# Altium project Super Seal Breakout.PrjPcb
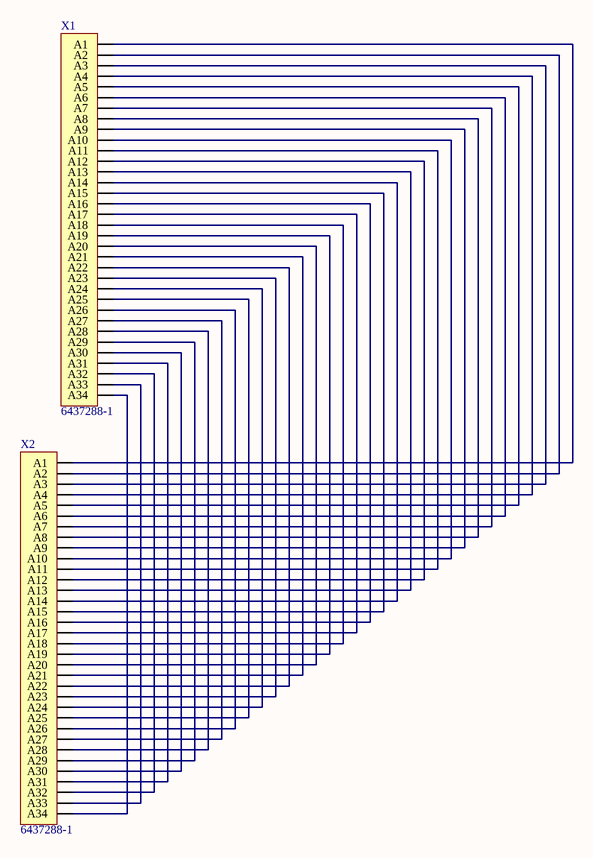
[diagram p0: breakout schematic.SchDoc]
1 sheet, 2 parts. Net scope: global (net labels, ports and power ports of the same name join across sheets).
Board file: Breakout pcb.PcbDoc

## Sheet breakout schematic.SchDoc
size A; SheetNumber: 1; SheetTotal: 1

### Parts
X1  6437288-1  [6437288-1]
X2  6437288-1  [6437288-1]

### Nets
NetX1_A1: X1.A1 X2.A1
NetX1_A2: X1.A2 X2.A2
NetX1_A3: X1.A3 X2.A3
NetX1_A4: X1.A4 X2.A4
NetX1_A5: X1.A5 X2.A5
NetX1_A6: X1.A6 X2.A6
NetX1_A7: X1.A7 X2.A7
NetX1_A8: X1.A8 X2.A8
NetX1_A9: X1.A9 X2.A9
NetX1_A10: X1.A10 X2.A10
NetX1_A11: X1.A11 X2.A11
NetX1_A12: X1.A12 X2.A12
NetX1_A13: X1.A13 X2.A13
NetX1_A14: X1.A14 X2.A14
NetX1_A15: X1.A15 X2.A15
NetX1_A16: X1.A16 X2.A16
NetX1_A17: X1.A17 X2.A17
NetX1_A18: X1.A18 X2.A18
NetX1_A19: X1.A19 X2.A19
NetX1_A20: X1.A20 X2.A20
NetX1_A21: X1.A21 X2.A21
NetX1_A22: X1.A22 X2.A22
NetX1_A23: X1.A23 X2.A23
NetX1_A24: X1.A24 X2.A24
NetX1_A25: X1.A25 X2.A25
NetX1_A26: X1.A26 X2.A26
NetX1_A27: X1.A27 X2.A27
NetX1_A28: X1.A28 X2.A28
NetX1_A29: X1.A29 X2.A29
NetX1_A30: X1.A30 X2.A30
NetX1_A31: X1.A31 X2.A31
NetX1_A32: X1.A32 X2.A32
NetX1_A33: X1.A33 X2.A33
NetX1_A34: X1.A34 X2.A34

### Library data of the parts
X1 X2 = 6437288-1: Superseal 34P; Circuits: 34; Name: 6437288-1; ComponentLink1Description: Digikey; ComponentLink1URL: https://www.digikey.com/products/en?mpart=6437288-1&&csp=WT.z_cid%3Dsp_8004_20120425_buynow%26TE_cid%3D8004-1541898693362